# EAGLE design 111_microphone (EAGLE 9.6.2)
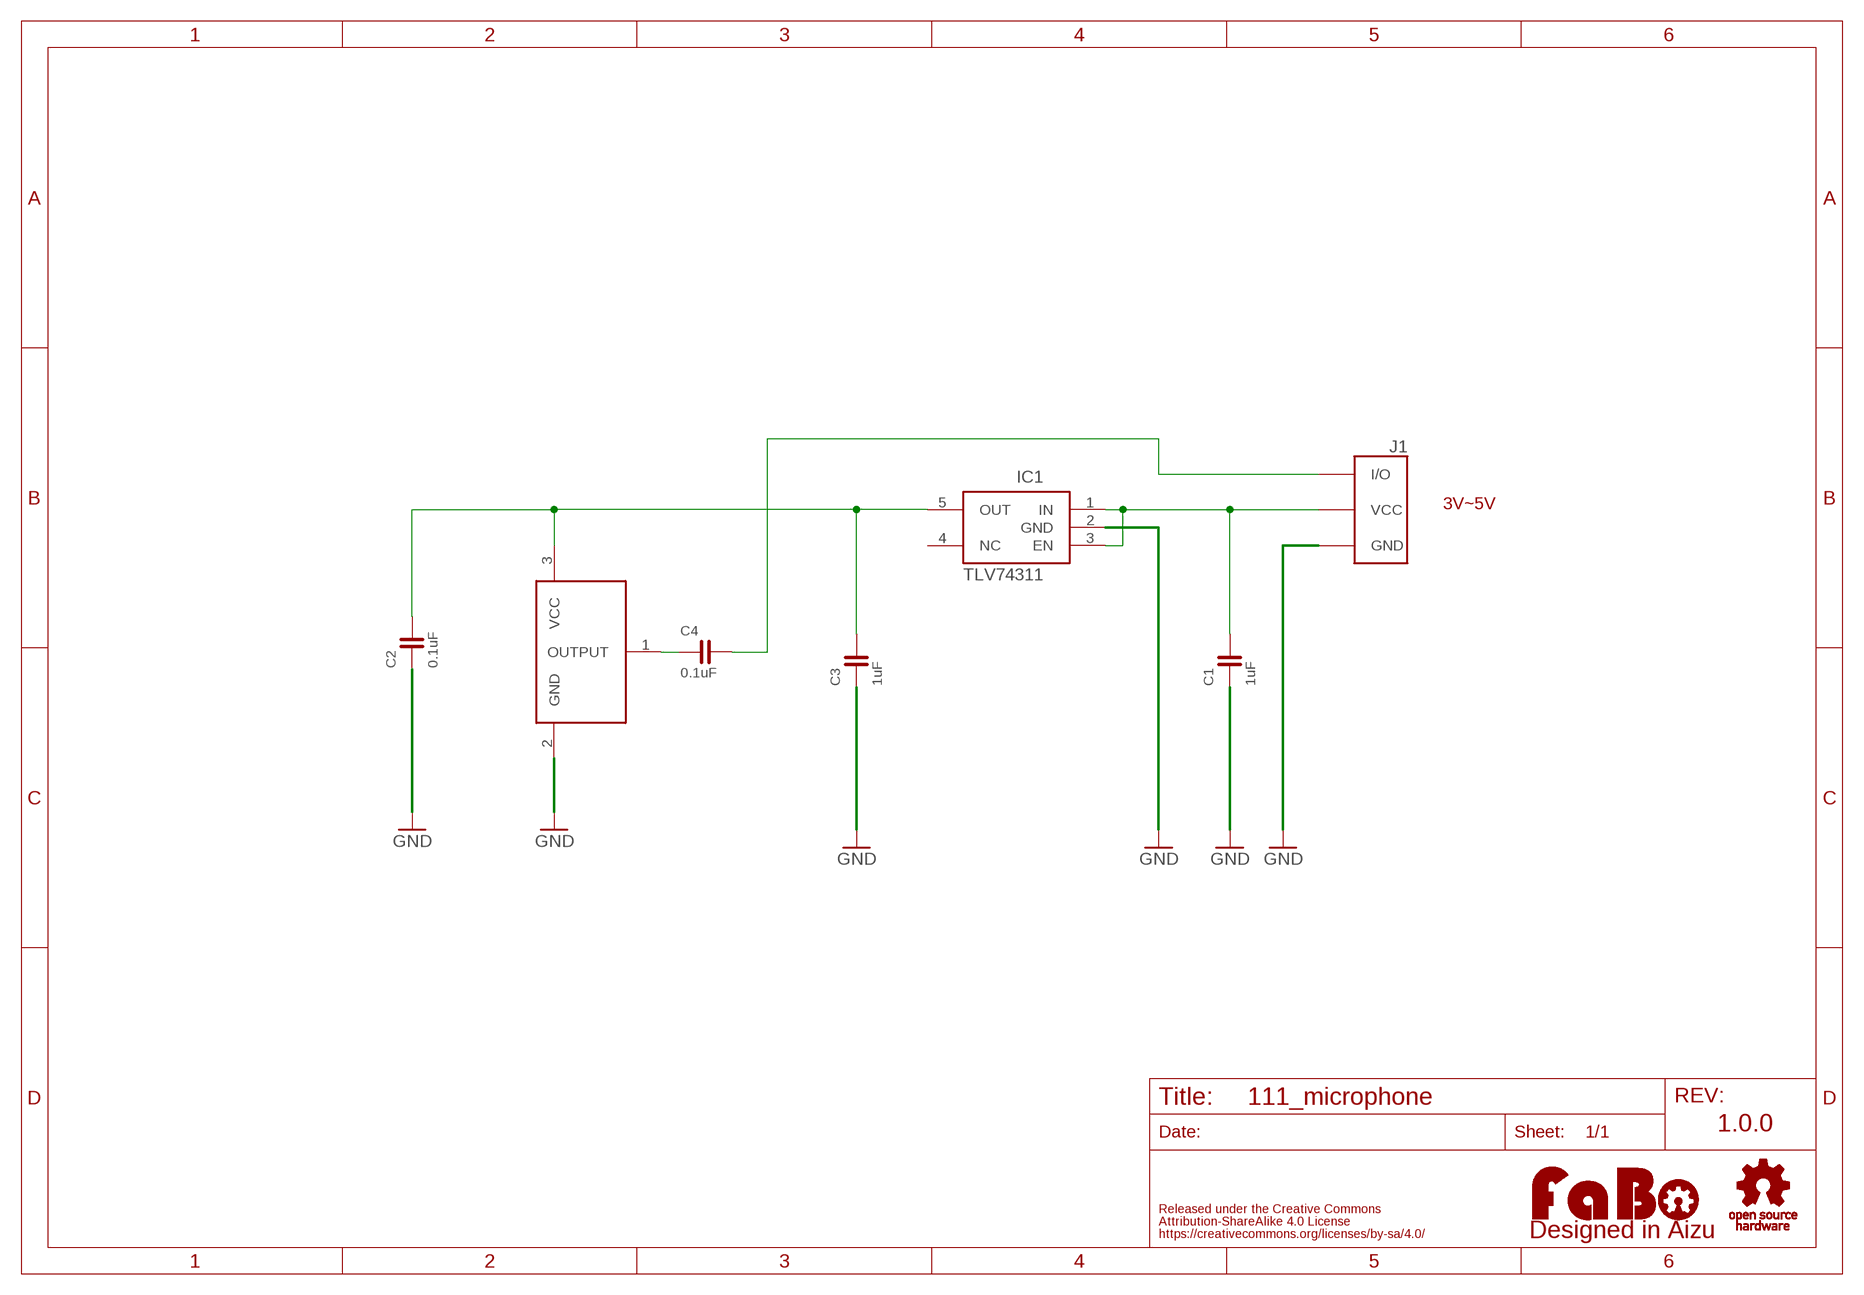
[diagram p0: schematic, sheet 1]

## Parts
C1  1uF  CAPACITOR-0603  [0603]
C2  0.1uF  CAPACITOR-0603  [0603]
C3  1uF  CAPACITOR-0603  [0603]
C4  0.1uF  CAPACITOR-0603  [0603]
IC1  TLV74311  [SOT-23-5]
ICS40310  ANALOG-MICICS40310  [ICS40310]
J1  FABO_BRICK_3PIN-03B-PASK-1_NAME_BOTTOM  [FABO_BRICK_3PIN_B03B-PASK-1_NAME_BOTTOM]
LOGO1  LOGO_FABO-S_BOTTOM  [LOGO_FABO_S_BOTTOM]
U$3  LOGO_OSHW-S_BOTTOM  [LOGO_OSHW_S_BOTTOM]

## Nets
GND: C1.1 C2.1 C3.1 IC1.2(GND) ICS40310.2(GND) J1.GND
N$1: C1.2 IC1.1(IN) IC1.3(EN) J1.VCC
N$2: C2.2 C3.2 IC1.5(OUT) ICS40310.3(VCC)
N$3: C4.2 J1.I/O
N$4: C4.1 ICS40310.1(OUTPUT)
Unconnected: IC1.4(NC)

## Notes on the sheet
- 3V~5V
- 1.0.0

## Library data of the parts
C1-C4 = FaBo-Capacitor:CAPACITOR: CAPACITOR
IC1 = FaBo-Supply:TLV74311
ICS40310 = FaBo-Sound:ANALOG-MIC
J1 = FaBo-Template:FABO_BRICK_3PIN: FaBo Brick 3pin
LOGO1 = component:LOGO_FABO
U$3 = component:LOGO_OSHW

## Board
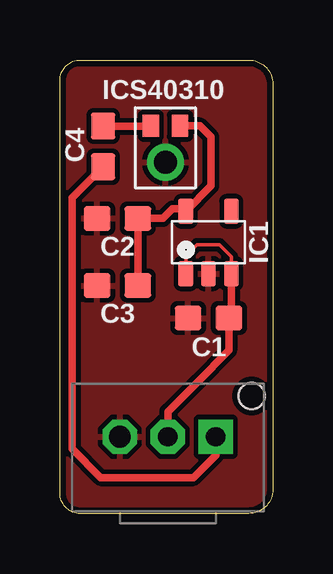
[diagram p1: board, top side]
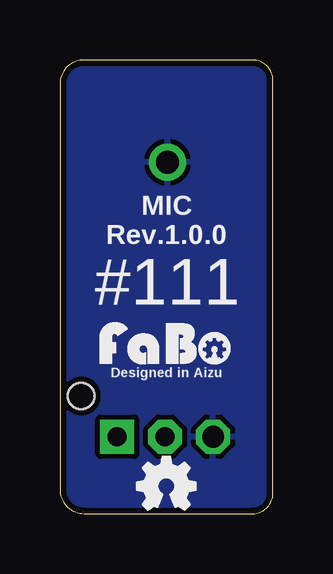
[diagram p2: board, bottom side, seen from below]

Size 8.89 x 18.9 mm. Coordinates in mm from the lower left corner, seen from the top.
Outline: 0,0.85 0,18.05 arc-90 0.85,18.9 7.88,18.9 arc-90 8.89,17.89 8.89,1.01 arc-90 7.88,0 0.85,0 arc-90 0,0.85
Copper layers (1*16): Top 0.035mm / dielectric 1.6mm / Bottom 0.035mm
Design rules "PCBway": minimum track width 6mil, minimum drill 12mil, track to track 6mil, track to pad 6mil, pad to pad 6mil, via to via 6mil, smd to smd 6mil, copper to edge 10mil, drill to drill 10mil, minimum pad ring 10mil, minimum via ring 6mil, stop-mask expansion 2mil, vias tented up to drill 100mil, thermal gap 8mil

### Footprints (pad centres in the part's own frame; a part is rotated, then mirrored left to right if it is on the bottom)
0603 = smd 1.1 x 1: 1 -0.85,0; 2 0.85,0
SOT-23-5 = smd 0.6 x 1.05: 1 -0.95,-1.3; 2 0,-1.3; 3 0.95,-1.3; 4 0.95,1.3; 5 -0.95,1.3
ICS40310 = smd 0.68 x 0.9: 1 -0.61,0.92; 3 0.61,0.92 | drill 0.95 pad 1.55: 2 0,-0.6
FABO_BRICK_3PIN_B03B-PASK-1_NAME_BOTTOM = drill 0.9 pad 1.422 octagon: GND -2,0 | drill 0.8 pad 1.422 square: I/O 2,0 | drill 0.8 pad 1.422 octagon: VCC 0,0 | hole 1.1: 3.5,1.7

### Placement (x,y rotation side)
C1  6.2,8.15 0 top
C2  2.4,12.3 0 top
C3  2.4,9.5 0 top
C4  1.8,15.3 270 top
IC1  6.2,11.3 0 top
ICS40310  4.4,15.24 0 top
J1  4.5,3.2 0 top
LOGO1  4.45,6.22 0 top
U$3  4.45,1.14 0 top

### Tracks (layer width: path | path; a pad name or v marks a point on that pad's centre or on a via)
GND
  pour Bottom (isolate 0.203): 0,0 0,19.05 8.89,19.05 8.89,0
  pour Top (isolate 0.203): 0,0 0,19.05 8.89,19.05 8.89,0
N$1
  Top 0.152: IC1.1 5.25,10.72 5.73,11.2 6.65,11.2 7.15,10.7 IC1.3
  Top 0.305: IC1.3 7.15,8.25 C1.2 7.05,6.8 5.71,5.46 5.59,5.33 4.5,4.25 J1.VCC
N$2
  Top 0.305: C3.2 3,9.75 3.25,10 C2.2 4.3,12.3 4.7,12.7 5.15,12.7 IC1.5 6.3,13.65 6.3,15.7 5.84,16.16 ICS40310.3
N$3
  Top 0.305: C4.2 0.5,13.15 0.5,2.71 1.71,1.5 5.56,1.5 6.5,2.44 J1.I/O
N$4
  Top 0.305: C4.1 ICS40310.1

### Text on the board
bPlace: MIC | Rev.1.0.0 | #111 | Designed in Aizu